# Altium project StudioLightingDriver.PrjPcb (part 1 of 2)
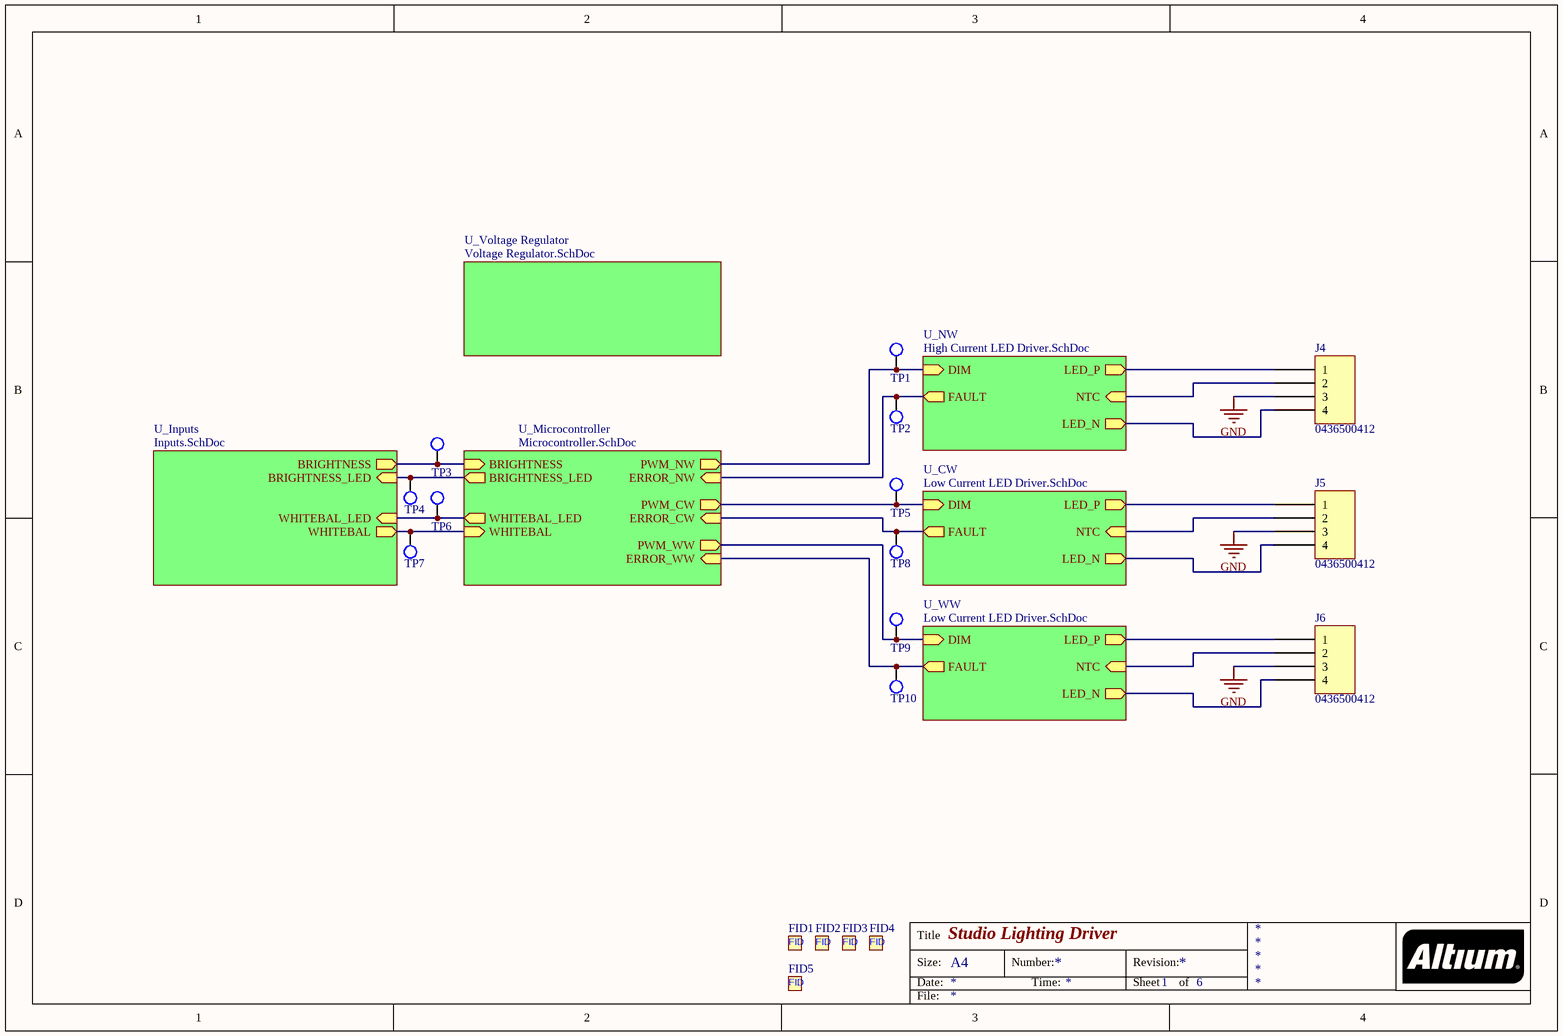
[diagram p0: Studio Lighting Driver.SchDoc]
6 sheets, 95 parts. Net scope: hierarchical (ports join the sheet entries above them; power ports are global).
Board file: LightingDriver.PcbDoc
Sheets:
  Studio Lighting Driver.SchDoc
    U_WW = Low Current LED Driver.SchDoc
    U_CW = Low Current LED Driver.SchDoc
    U_NW = High Current LED Driver.SchDoc
    U_Microcontroller = Microcontroller.SchDoc
    U_Voltage Regulator = Voltage Regulator.SchDoc
    U_Inputs = Inputs.SchDoc

## Sheet Studio Lighting Driver.SchDoc: Studio Lighting Driver
size A4; SheetNumber: 1; SheetTotal: 6

### Parts
FID1  Fiducial  [Fiducial-1mm]  (value not drawn)
FID2  Fiducial  [Fiducial-1mm]  (value not drawn)
FID3  Fiducial  [Fiducial-1mm]  (value not drawn)
FID4  Fiducial  [Fiducial-1mm]  (value not drawn)
FID5  Fiducial  [Fiducial-1mm]  (value not drawn)
J4  0436500412  [MOLEX 436500412]
J5  0436500412  [MOLEX 436500412]
J6  0436500412  [MOLEX 436500412]
TP1  Test Point  [TestPoint-1.5mm]  (value not drawn)  (no BOM)
TP2  Test Point  [TestPoint-1.5mm]  (value not drawn)  (no BOM)
TP3  Test Point  [TestPoint-1.5mm]  (value not drawn)  (no BOM)
TP4  Test Point  [TestPoint-1.5mm]  (value not drawn)  (no BOM)
TP5  Test Point  [TestPoint-1.5mm]  (value not drawn)  (no BOM)
TP6  Test Point  [TestPoint-1.5mm]  (value not drawn)  (no BOM)
TP7  Test Point  [TestPoint-1.5mm]  (value not drawn)  (no BOM)
TP8  Test Point  [TestPoint-1.5mm]  (value not drawn)  (no BOM)
TP9  Test Point  [TestPoint-1.5mm]  (value not drawn)  (no BOM)
TP10  Test Point  [TestPoint-1.5mm]  (value not drawn)  (no BOM)

### Sub-sheets
U_CW = Low Current LED Driver.SchDoc: LED_P (out), LED_N (out), DIM (in), NTC (in), FAULT (out)
U_Inputs = Inputs.SchDoc: BRIGHTNESS (out), BRIGHTNESS_LED (in), WHITEBAL (out), WHITEBAL_LED (in)
U_Microcontroller = Microcontroller.SchDoc: BRIGHTNESS (in), WHITEBAL (in), PWM_CW (out), PWM_WW (out), PWM_NW (out), ERROR_NW (in), ERROR_WW (in), ERROR_CW (in), BRIGHTNESS_LED (out), WHITEBAL_LED (out)
U_NW = High Current LED Driver.SchDoc: LED_P (out), LED_N (out), DIM (in), NTC (in), FAULT (out)
U_Voltage Regulator = Voltage Regulator.SchDoc: no entries
U_WW = Low Current LED Driver.SchDoc: LED_P (out), LED_N (out), DIM (in), NTC (in), FAULT (out)

### Nets
GND: J4.3 J5.3 J6.3
BRIGHTNESS: TP3.1(TP) ; sheet U_Microcontroller/BRIGHTNESS, sheet U_Inputs/BRIGHTNESS
BRIGHTNESS_LED: TP4.1(TP) ; sheet U_Microcontroller/BRIGHTNESS_LED, sheet U_Inputs/BRIGHTNESS_LED
DIM: TP1.1(TP) ; sheet U_NW/DIM, sheet U_Microcontroller/PWM_NW
DIM: TP9.1(TP) ; sheet U_WW/DIM, sheet U_Microcontroller/PWM_WW  [a separate net that carries the same name]
DIM: TP5.1(TP) ; sheet U_CW/DIM, sheet U_Microcontroller/PWM_CW  [a separate net that carries the same name]
ERROR_CW: TP8.1(TP) ; sheet U_CW/FAULT, sheet U_Microcontroller/ERROR_CW
ERROR_NW: TP2.1(TP) ; sheet U_NW/FAULT, sheet U_Microcontroller/ERROR_NW
ERROR_WW: TP10.1(TP) ; sheet U_WW/FAULT, sheet U_Microcontroller/ERROR_WW
LED_N: J4.4 ; sheet U_NW/LED_N
LED_N: J5.4 ; sheet U_CW/LED_N  [a separate net that carries the same name]
LED_N: J6.4 ; sheet U_WW/LED_N  [a separate net that carries the same name]
LED_P: J4.1 ; sheet U_NW/LED_P
LED_P: J5.1 ; sheet U_CW/LED_P  [a separate net that carries the same name]
LED_P: J6.1 ; sheet U_WW/LED_P  [a separate net that carries the same name]
NTC: J4.2 ; sheet U_NW/NTC
NTC: J5.2 ; sheet U_CW/NTC  [a separate net that carries the same name]
NTC: J6.2 ; sheet U_WW/NTC  [a separate net that carries the same name]
WHITEBAL: TP7.1(TP) ; sheet U_Microcontroller/WHITEBAL, sheet U_Inputs/WHITEBAL
WHITEBAL_LED: TP6.1(TP) ; sheet U_Microcontroller/WHITEBAL_LED, sheet U_Inputs/WHITEBAL_LED

### Notes on the sheet
- Title
- Size:
- Date:
- A4
- Number:
- Time:
- Revision:
- Sheet
- of
- File:
- (in symbol Fiducial) FID

### Library data of the parts
J4-J6 = 0436500412: CONN HEADER SMD R/A 4POS 3MM; Manufacturer: Molex; Material Flammability Rating: UL94 V-0; Number of Positions: 4; Number of Positions Loaded: All; Pitch - Mating: 0.118" (3.00mm); Shrouding: Shrouded - 4 Wall; Style: Board to Cable/Wire; Part Number: 0436500412; ComponentLink1Description: Datasheet; ComponentLink1URL: https://www.molex.com/pdm_docs/sd/436500412_sd.pdf; ComponentLink2Description: DigiKey Link; ComponentLink2URL: https://www.digikey.com/en/products/detail/molex/0436500412/3451041; Connector Type: Header; Contact Finish - Mating: Tin; Contact Finish - Post: Tin; Contact Finish Thickness - Mating: 60.0µin (1.52µm); Contact Material: Brass; Contact Shape: Square; Contact Type: Male Pin; Fastening Type: Locking Ramp; Features: Solder Retention; Insulation Color: Black; Insulation Height: 0.172" (4.37mm); Insulation Material: Liquid Crystal Polymer (LCP), Glass Filled; LastUpdated: 21/03/2022 20:35:03; Lifecycle Status: Active; Minimum Order: 1; Mounting Type: Surface Mount, Right Angle; Number of Rows: 1; Packaging: TapeAndReel; PartId: 134; Part Status: Active; Price: 1.64; Series: Micro-Fit 3.0 43650; Supplier 1: DigiKey; Supplier Part Number 1: WM1892CT-ND; Termination: Solder

## Sheet Low Current LED Driver.SchDoc: Low Current Driver
size A4; SheetNumber: 2; SheetTotal: 6
Used 2 times, as channels U_WW, U_CW. Parts and nets are listed once, with the designators drawn on the sheet.
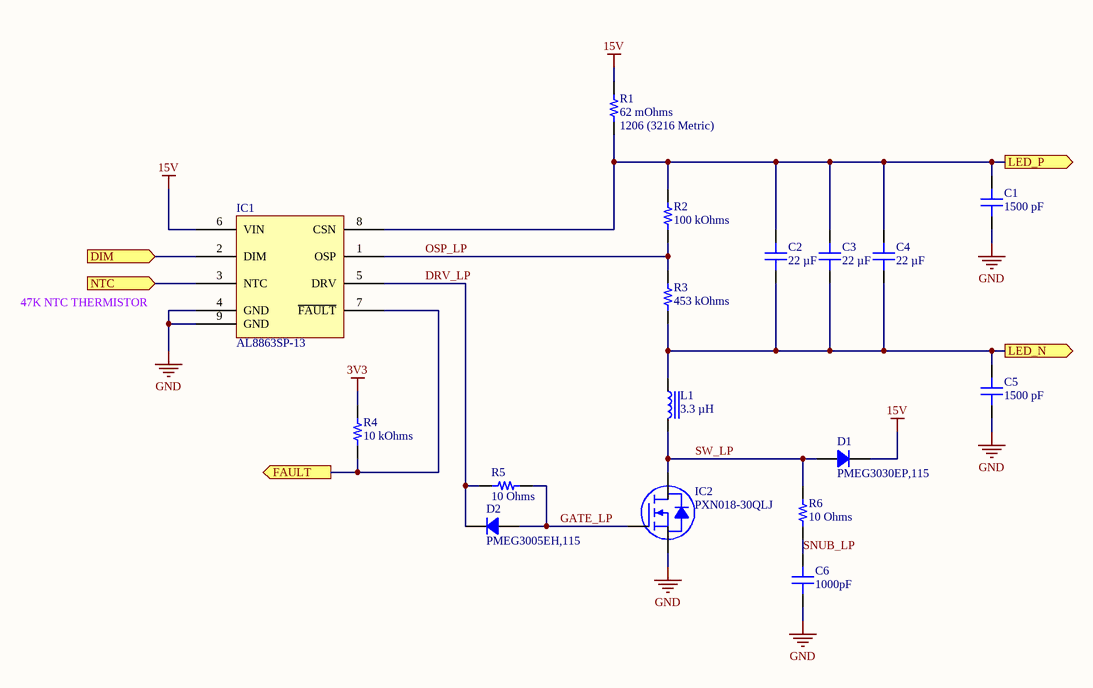
[diagram p1: Low Current LED Driver.SchDoc]

### Parts
C1  1500 pF  [CAP 0603_1608]
C2  22 µF  [CAP 1210_3225 - 1MM]
C3  22 µF  [CAP 1210_3225 - 1MM]
C4  22 µF  [CAP 1210_3225 - 1MM]
C5  1500 pF  [CAP 0603_1608]
C6  1000pF  [CAP 0603_1608]
D1  PMEG3030EP,115  [NEXPERIA SOD-128 CFP5]
D2  PMEG3005EH,115  [SOD123F]
IC1  AL8863SP-13  [DIODES INC SO-8EP]
IC2  PXN018-30QLJ  [NEXPERIA MLPAK33 SOT8002-1]
L1  3.3 µH  [TAIYO YUDEN NRS8030]
R1  62 mOhms  Package / Case: 1206 (3216 Metric)  [STACKPOLE CSR1206]
R2  100 kOhms  [RES 0603_1608]
R3  453 kOhms  [RES 0603_1608]
R4  10 kOhms  [RES 0603_1608]
R5  10 Ohms  [RES 0805_2012]
R6  10 Ohms  [RES 0805_2012]

### Ports
DIM (in), FAULT (out), LED_N (out), LED_P (out), NTC (in)

### Nets
3V3: R4.2
15V: D1.2 IC1.6(VIN) R1.2
GND: C1.1 C5.1 C6.1 IC1.4(GND) IC1.9(GND) IC2.S
DIM: IC1.2(DIM) ; port DIM
DRV_LP: D2.2 IC1.5(DRV) R5.1
FAULT: IC1.7(~{FAULT}) R4.1 ; port FAULT
GATE_LP: D2.1 IC2.G R5.2
LED_N: C2.1 C3.1 C4.1 C5.2 L1.2 R3.1 ; port LED_N
LED_P: C1.2 C2.2 C3.2 C4.2 IC1.8(CSN) R1.1 R2.2 ; port LED_P
NTC: IC1.3(NTC) ; port NTC
OSP_LP: IC1.1(OSP) R2.1 R3.2
SNUB_LP: C6.2 R6.1
SW_LP: D1.1 IC2.D L1.1 R6.2

### Channels
U_WW: designators end in _U_WW; ports DIM=DIM FAULT=ERROR_WW LED_N=LED_N LED_P=LED_P NTC=NTC
U_CW: designators end in _U_CW; ports DIM=DIM FAULT=ERROR_CW LED_N=LED_N LED_P=LED_P NTC=NTC

### Notes on the sheet
- 47K NTC THERMISTOR
- Title
- Size:
- Date:
- A4
- Number:
- Time:
- Revision:
- Sheet
- of
- File:

### Library data of the parts
C1 C5 = 0603N152J500CT: CAP CER 1500PF 50V C0G/NP0 0603; manufacturer: Walsin Technology Corporation; Temperature Coefficient: C0G, NP0; Tolerance: ±5%; Part Number: 0603N152J500CT; Value: 1500 pF; Applications: General Purpose; Capacitance: 1500 pF; componentlink1description: Datasheet; componentlink1url: http://www.passivecomponent.com/wp-content/uploads/2018/10/MLCC.pdf; componentlink2description: DigiKey Link; componentlink2url: https://www.digikey.com/en/products/detail/walsin-technology-corporation/0603N152J500CT/9354986; Device Package: 0603 (1608 Metric); lastupdated: 16/03/2022 06:22:23; Lifecycle Status: Active; Minimum Order: 1; Mounting Type: Surface Mount, MLCC; Operating Temperature: -55°C ~ 125°C; Package / Case: 0603 (1608 Metric); packaging: TapeAndReel; partid: 13065; Part Status: Active; price: 0.01; series: -; Size / Dimension: 0.063" L x 0.031" W (1.60mm x 0.80mm); Supplier 1: DigiKey; Supplier Part Number 1: 1292-1489-1-ND; Thickness (Max): 0.037" (0.95mm); Voltage - Rated: 50V
C2-C4 = CL32A226KAJNNNE: CAP CER 22UF 25V X5R 1210; manufacturer: Samsung Electro-Mechanics; Tolerance: ±10%; Part Number: CL32A226KAJNNNE; Value: 22 µF; Applications: General Purpose; Capacitance: 22 µF; componentlink1description: Datasheet; componentlink1url: http://www.samsungsem.com/kr/support/product-search/mlcc/CL32A226KAJNNNE.jsp; componentlink2description: DigiKey Link; componentlink2url: https://www.digikey.com/en/products/detail/samsung-electro-mechanics/CL32A226KAJNNNE/3886759; Device Package: 1210 (3225 Metric); lastupdated: 16/03/2022 06:41:57; Lifecycle Status: Active; Minimum Order: 1; Mounting Type: Surface Mount, MLCC; Operating Temperature: -55°C ~ 85°C; Package / Case: 1210 (3225 Metric); packaging: TapeAndReel; partid: 39435; Part Status: Active; price: 0.11; series: CL; Size / Dimension: 0.126" L x 0.098" W (3.20mm x 2.50mm); Supplier 1: DigiKey; Supplier Part Number 1: 1276-1101-1-ND; Temperature Coefficient: X5R; Thickness (Max): 0.106" (2.70mm); Voltage - Rated: 25V
C6 = 06035C102KAT2A: CAP CER 1000PF 50V X7R 0603; manufacturer: AVX Corporation; Tolerance: ±10%; Part Number: 06035C102KAT2A; Value: 1000pF; Applications: General Purpose; Capacitance: 1000pF; componentlink1description: Datasheet; componentlink1url: http://datasheets.avx.com/X7RDielectric.pdf; componentlink2description: DigiKey Link; componentlink2url: http://digikey.com/product-detail/en/avx-corporation/06035C102KAT2A/478-1215-1-ND/564247; Device Package: 0603 (1608 Metric); lastupdated: 02/09/2020 01:03:30; Lifecycle Status: Active; Minimum Order: 1; Mounting Type: Surface Mount, MLCC; Operating Temperature: -55°C ~ 125°C; Package / Case: 0603 (1608 Metric); packaging: TapeAndReel; partid: 5544; Part Status: Active; price: 0.01; series: -; Size / Dimension: 0.063" L x 0.032" W (1.60mm x 0.81mm); Supplier 1: DigiKey; Supplier Part Number 1: 478-1215-1-ND; Temperature Coefficient: X7R; Thickness (Max): 0.035" (0.90mm); Voltage - Rated: 50V
D1 = PMEG3030EP,115: DIODE SCHOTTKY 30V 3A CFP5; Manufacturer: Nexperia USA Inc.; Capacitance @ Vr, F: 470pF @ 1V, 1MHz; Current - Reverse Leakage @ Vr: 5 mA @ 30 V; Speed: Fast Recovery =< 500ns, > 200mA (Io); Voltage - Forward (Vf) (Max) @ If: 360 mV @ 3 A; Part Number: PMEG3030EP,115; ComponentLink1Description: Datasheet; ComponentLink1URL: https://assets.nexperia.com/documents/data-sheet/PMEG3030EP.pdf; ComponentLink2Description: DigiKey Link; ComponentLink2URL: https://www.digikey.com/en/products/detail/nexperia-usa-inc/PMEG3030EP-115/2228693; Current - Average Rectified (Io): 3A; Diode Type: Schottky; LastUpdated: 16/03/2022 11:28:51; Lifecycle Status: Active; Minimum Order: 1; Mounting Type: Surface Mount; Operating Temperature - Junction: 150°C (Max); Package / Case: SOD-128; Packaging: TapeAndReel; PartId: 3379; Part Status: Active; Price: 0.16; Series: -; Supplier 1: DigiKey; Supplier Part Number 1: 1727-5324-1-ND; Supplier Device Package: SOD-128/CFP5; Voltage - DC Reverse (Vr) (Max): 30 V
D2 = PMEG3005EH,115: DIODE SCHOTTKY 30V 500MA SOD123F; Manufacturer: Nexperia USA Inc.; Capacitance @ Vr, F: 70pF @ 1V, 1MHz; Current - Average Rectified (Io): 500mA (DC); Current - Reverse Leakage @ Vr: 150 µA @ 30 V; Speed: Fast Recovery =< 500ns, > 200mA (Io); Voltage - Forward (Vf) (Max) @ If: 430 mV @ 500 mA; Part Number: PMEG3005EH,115; ComponentLink1Description: Datasheet; ComponentLink1URL: https://assets.nexperia.com/documents/data-sheet/PMEGXX05EH_EJ_SER.pdf; ComponentLink2Description: DigiKey Link; ComponentLink2URL: https://www.digikey.com/en/products/detail/nexperia-usa-inc/PMEG3005EH-115/1157689; Diode Type: Schottky; LastUpdated: 16/03/2022 07:00:41; Lifecycle Status: Active; Minimum Order: 1; Mounting Type: Surface Mount; Operating Temperature - Junction: 150°C (Max); Package / Case: SOD-123F; Packaging: TapeAndReel; PartId: 2471; Part Status: Active; Price: 0.05; Series: -; Supplier 1: DigiKey; Supplier Part Number 1: 1727-3865-1-ND; Supplier Device Package: SOD-123F; Voltage - DC Reverse (Vr) (Max): 30 V
IC1 = AL8863SP-13: LED MV INT SWITCH SO-8EP; Manufacturer: Diodes Incorporated; Dimming: PWM; Frequency: 50kHz ~ 1MHz; Internal Switch(s): No; Number of Outputs: 1; Topology: Step-Down (Buck); Voltage - Supply (Max): 60V; Voltage - Supply (Min): 4.5V; Part Number: AL8863SP-13; Applications: Commercial & Industrial Lighting; ComponentLink1Description: Datasheet; ComponentLink1URL: https://www.diodes.com/assets/Datasheets/AL8863.pdf; ComponentLink2Description: DigiKey Link; ComponentLink2URL: https://www.digikey.com/en/products/detail/diodes-incorporated/AL8863SP-13/10481155; LastUpdated: 16/03/2022 13:00:06; Lifecycle Status: Active; Minimum Order: 1; Mounting Type: Surface Mount; Operating Temperature: -40°C ~ 125°C (TA); Package / Case: 8-SOIC (0.154", 3.90mm Width) Exposed Pad; Packaging: TapeAndReel; PartId: 9; Part Status: Active; Price: 0.23; Series: -; Supplier 1: DigiKey; Supplier Part Number 1: 31-AL8863SP-13CT-ND; Supplier Device Package: 8-SO-EP; Type: DC DC Controller
IC2 = PXN018-30QLJ: PXN018-30QL/SOT8002/MLPAK33; Manufacturer: Nexperia USA Inc.; Current - Continuous Drain (Id) @ 25°C: 7.5A (Ta), 19.2A (Tc); Drain to Source Voltage (Vdss): 30 V; Drive Voltage (Max Rds On,  Min Rds On): 4.5V, 10V; FET Type: N-Channel; Gate Charge (Qg) (Max) @ Vgs: 10.8 nC @ 10 V; Input Capacitance (Ciss) (Max) @ Vds: 447 pF @ 15 V; Power Dissipation (Max): 1.7W (Ta), 10.9W (Tc); Rds On (Max) @ Id, Vgs: 18mOhm @ 7.5A, 10V; Vgs (Max): ±20V; Vgs(th) (Max) @ Id: 2.5V @ 250µA; Part Number: PXN018-30QLJ; ComponentLink1Description: Datasheet; ComponentLink1URL: https://assets.nexperia.com/documents/data-sheet/PXN018-30QL.pdf; ComponentLink2Description: DigiKey Link; ComponentLink2URL: https://www.digikey.com/en/products/detail/nexperia-usa-inc/PXN018-30QLJ/13690066; LastUpdated: 16/03/2022 13:32:54; Lifecycle Status: Active; Minimum Order: 1; Mounting Type: Surface Mount; Operating Temperature: -55°C ~ 150°C (TJ); Packaging: TapeAndReel; Part Status: Active; Price: 0.18; Series: -; Supplier 1: DigiKey; Supplier Part Number 1: 1727-PXN018-30QLJCT-ND; Supplier Device Package: MLPAK33; Technology: MOSFET (Metal Oxide)
L1 = NRS8030T3R3MJGJ: FIXED IND 3.3UH 4.3A 19 MOHM SMD; Manufacturer: Taiyo Yuden; Current - Saturation: 4.2A; DC Resistance (DCR): 19mOhm; Frequency - Self Resonant: 50MHz; Inductance Frequency - Test: 100 kHz; Material - Core: Ferrite; Shielding: Shielded; Tolerance: ±20%; Type: Wirewound; Part Number: NRS8030T3R3MJGJ; ComponentLink1Description: Datasheet; ComponentLink1URL: https://www.yuden.co.jp/productdata/catalog/wound04_e.pdf; ComponentLink2Description: DigiKey Link; ComponentLink2URL: https://www.digikey.com/en/products/detail/taiyo-yuden/NRS8030T3R3MJGJ/2666005; Current Rating (Amps): 4.3 A; Device Package: Nonstandard; Height - Seated (Max): 0.118" (3.00mm); Inductance: 3.3 µH; LastUpdated: 16/03/2022 11:26:54; Lifecycle Status: Active; Minimum Order: 1; Mounting Type: Surface Mount; Operating Temperature: -25°C ~ 125°C; Package / Case: Nonstandard; Packaging: TapeAndReel; PartId: 5492; Part Status: Active; Price: 0.21; Series: NR, S Type; Size / Dimension: 0.315" L x 0.315" W (8.00mm x 8.00mm); Supplier 1: DigiKey; Supplier Part Number 1: 587-2967-1-ND; Value: 3.3 µH
R1 = RLP73N2BR062FTDF: RES 0.062 OHM 1% 1/2W 1206; Manufacturer: TE Connectivity Passive Product; Power (Watts): 0.5W, 1/2W; Temperature Coefficient: ±300ppm/°C; Part Number: RLP73N2BR062FTDF; ComponentLink1Description: Datasheet; ComponentLink1URL: https://www.te.com/commerce/DocumentDelivery/DDEController?Action=srchrtrv&DocNm=1773269&DocType=DS&DocLang=English; ComponentLink2Description: DigiKey Link; ComponentLink2URL: http://digikey.com/product-detail/en/te-connectivity-passive-product/RLP73N2BR062FTDF/A109640CT-ND/4032406; Composition: Thick Film; Device Package: 1206 (3216 Metric); Features: Current Sense; Height - Seated (Max): 0.026" (0.65mm); LastUpdated: 16/03/2022 06:58:00; Lifecycle Status: Active; Minimum Order: 1; Number of Terminations: 2; Operating Temperature: -55°C ~ 155°C; Packaging: TapeAndReel; PartId: 2646; Part Status: Active; Price: 0.14; Resistance: 62 mOhms; Series: RL73, CGS; Size / Dimension: 0.122" L x 0.061" W (3.10mm x 1.55mm); Supplier 1: DigiKey; Supplier Part Number 1: A109640CT-ND; Supplier Device Package: 1206; Tolerance: ±1%; Value: 62 mOhms
R2 = CRCW0603100KFKEAC: RES 100K OHM 1% 1/10W 0603; Manufacturer: Vishay Dale; Power (Watts): 0.1W, 1/10W; Temperature Coefficient: ±100ppm/°C; Part Number: CRCW0603100KFKEAC; Value: 100 kOhms; ComponentLink1Description: Datasheet; ComponentLink1URL: http://www.vishay.com/docs/28773/crcwce3.pdf; ComponentLink2Description: DigiKey Link; ComponentLink2URL: https://www.digikey.com/en/products/detail/vishay-dale/CRCW0603100KFKEAC/7928372; Composition: Thick Film; Device Package: 0603 (1608 Metric); Height - Seated (Max): 0.022" (0.55mm); LastUpdated: 16/03/2022 06:41:03; Lifecycle Status: Active; Minimum Order: 1; Number of Terminations: 2; Operating Temperature: -55°C ~ 155°C; Package / Case: 0603 (1608 Metric); Packaging: CutTape; PartId: 12549; Part Status: Active; Price: 0.01; Resistance: 100 kOhms; Series: CRCW-C; Supplier 1: DigiKey; Supplier Part Number 1: 541-3950-1-ND; Supplier Device Package: 0603; Tolerance: ±1%
R3 = RMCF0603FT453K: RES 453K OHM 1% 1/10W 0603; Manufacturer: Stackpole Electronics Inc; Power (Watts): 0.1W, 1/10W; Temperature Coefficient: ±100ppm/°C; Part Number: RMCF0603FT453K; Value: 453 kOhms; ComponentLink1Description: Datasheet; ComponentLink1URL: https://www.seielect.com/catalog/sei-rmcf_rmcp.pdf; ComponentLink2Description: DigiKey Link; ComponentLink2URL: https://www.digikey.com/en/products/detail/stackpole-electronics-inc/RMCF0603FT453K/1761122; Composition: Thick Film; Device Package: 0603 (1608 Metric); Features: Automotive AEC-Q200; Height - Seated (Max): 0.022" (0.55mm); LastUpdated: 16/03/2022 06:40:25; Lifecycle Status: Active; Minimum Order: 1; Number of Terminations: 2; Operating Temperature: -55°C ~ 155°C; Package / Case: 0603 (1608 Metric); Packaging: CutTape; PartId: 22558; Part Status: Active; Price: 0.01; Ratings: AEC-Q200; Resistance: 453 kOhms; Series: RMCF; Size / Dimension: 0.061" L x 0.031" W (1.55mm x 0.80mm); Supplier 1: DigiKey; Supplier Part Number 1: RMCF0603FT453KCT-ND; Supplier Device Package: 0603; Tolerance: ±1%
R4 = ERJ-3GEYJ103V: RES SMD 10K OHM 5% 1/10W 0603; Manufacturer: Panasonic Electronic Components; Power (Watts): 0.1W, 1/10W; Temperature Coefficient: ±200ppm/°C; Part Number: ERJ-3GEYJ103V; Value: 10 kOhms; ComponentLink1Description: Datasheet; ComponentLink1URL: http://industrial.panasonic.com/www-cgi/jvcr13pz.cgi?E+PZ+3+AOA0001+ERJ3GEYJ103V+7+WW; ComponentLink2Description: DigiKey Link; ComponentLink2URL: https://www.digikey.com/en/products/detail/panasonic-electronic-components/ERJ-3GEYJ103V/135662; Composition: Thick Film; Device Package: 0603 (1608 Metric); Features: Automotive AEC-Q200; Height - Seated (Max): 0.022" (0.55mm); LastUpdated: 16/03/2022 06:40:24; Lifecycle Status: Active; Minimum Order: 1; Number of Terminations: 2; Operating Temperature: -55°C ~ 155°C; Package / Case: 0603 (1608 Metric); Packaging: TapeAndReel; PartId: 22604; Part Status: Active; Price: 0.01; Ratings: AEC-Q200; Resistance: 10 kOhms; Series: ERJ-3G; Size / Dimension: 0.063" L x 0.031" W (1.60mm x 0.80mm); Supplier 1: DigiKey; Supplier Part Number 1: P10KGCT-ND; Supplier Device Package: 0603; Tolerance: ±5%
R5 R6 = CRCW080510R0JNEAC: RES 10 OHM 5% 1/8W 0805; Manufacturer: Vishay Dale; Power (Watts): 0.125W, 1/8W; Temperature Coefficient: ±200ppm/°C; Part Number: CRCW080510R0JNEAC; Value: 10 Ohms; ComponentLink1Description: Datasheet; ComponentLink1URL: http://www.vishay.com/docs/28773/crcwce3.pdf; ComponentLink2Description: DigiKey Link; ComponentLink2URL: https://www.digikey.com/en/products/detail/vishay-dale/CRCW080510R0JNEAC/7928589; Composition: Thick Film; Device Package: 0805 (2012 Metric); Height - Seated (Max): 0.024" (0.60mm); LastUpdated: 16/03/2022 06:53:04; Lifecycle Status: Active; Minimum Order: 1; Number of Terminations: 2; Operating Temperature: -55°C ~ 155°C; Package / Case: 0805 (2012 Metric); Packaging: TapeAndReel; PartId: 37142; Part Status: Active; Price: 0.01; Resistance: 10 Ohms; Series: CRCW-C; Size / Dimension: 0.079" L x 0.049" W (2.00mm x 1.25mm); Supplier 1: DigiKey; Supplier Part Number 1: 541-4167-1-ND; Supplier Device Package: 0805; Tolerance: ±5%

## Sheet High Current LED Driver.SchDoc: High Current Driver
size A4; SheetNumber: 3; SheetTotal: 6
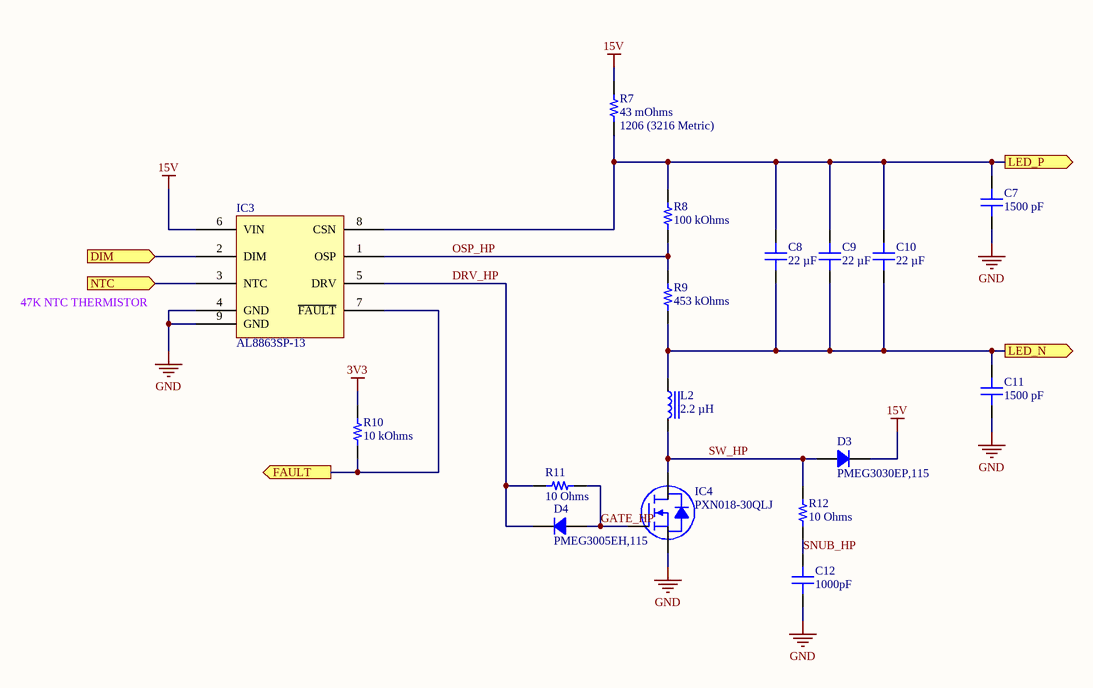
[diagram p2: High Current LED Driver.SchDoc]

### Parts
C7  1500 pF  [CAP 0603_1608]
C8  22 µF  [CAP 1210_3225 - 1MM]
C9  22 µF  [CAP 1210_3225 - 1MM]
C10  22 µF  [CAP 1210_3225 - 1MM]
C11  1500 pF  [CAP 0603_1608]
C12  1000pF  [CAP 0603_1608]
D3  PMEG3030EP,115  [NEXPERIA SOD-128 CFP5]
D4  PMEG3005EH,115  [SOD123F]
IC3  AL8863SP-13  [DIODES INC SO-8EP]
IC4  PXN018-30QLJ  [NEXPERIA MLPAK33 SOT8002-1]
L2  2.2 µH  [TAIYO YUDEN NRS8030]
R7  43 mOhms  Package / Case: 1206 (3216 Metric)  [STACKPOLE CSR1206]
R8  100 kOhms  [RES 0603_1608]
R9  453 kOhms  [RES 0603_1608]
R10  10 kOhms  [RES 0603_1608]
R11  10 Ohms  [RES 0805_2012]
R12  10 Ohms  [RES 0805_2012]

### Ports
DIM (in), FAULT (out), LED_N (out), LED_P (out), NTC (in)

### Nets
3V3: R10.2
15V: D3.2 IC3.6(VIN) R7.2
GND: C7.1 C11.1 C12.1 IC3.4(GND) IC3.9(GND) IC4.S
DIM: IC3.2(DIM) ; port DIM
DRV_HP: D4.2 IC3.5(DRV) R11.1
ERROR_NW: IC3.7(~{FAULT}) R10.1 ; port FAULT
GATE_HP: D4.1 IC4.G R11.2
LED_N: C8.1 C9.1 C10.1 C11.2 L2.2 R9.1 ; port LED_N
LED_P: C7.2 C8.2 C9.2 C10.2 IC3.8(CSN) R7.1 R8.2 ; port LED_P
NTC: IC3.3(NTC) ; port NTC
OSP_HP: IC3.1(OSP) R8.1 R9.2
SNUB_HP: C12.2 R12.1
SW_HP: D3.1 IC4.D L2.1 R12.2

### Notes on the sheet
- 47K NTC THERMISTOR
- Title
- Size:
- Date:
- A4
- Number:
- Time:
- Revision:
- Sheet
- of
- File:

### Library data of the parts
C7 C11 = 0603N152J500CT: as C1 on sheet Low Current LED Driver; Part Number: 0603N152J500CT; Value: 1500 pF; Applications: General Purpose; Capacitance: 1500 pF; componentlink1description: Datasheet; componentlink1url: http://www.passivecomponent.com/wp-content/uploads/2018/10/MLCC.pdf; componentlink2description: DigiKey Link; componentlink2url: https://www.digikey.com/en/products/detail/walsin-technology-corporation/0603N152J500CT/9354986; Device Package: 0603 (1608 Metric); lastupdated: 16/03/2022 06:22:23; Lifecycle Status: Active; Minimum Order: 1; Mounting Type: Surface Mount, MLCC; Operating Temperature: -55°C ~ 125°C; Package / Case: 0603 (1608 Metric); packaging: TapeAndReel; partid: 13065; Part Status: Active; price: 0.01; series: -; Size / Dimension: 0.063" L x 0.031" W (1.60mm x 0.80mm); Supplier 1: DigiKey; Supplier Part Number 1: 1292-1489-1-ND; Thickness (Max): 0.037" (0.95mm); Voltage - Rated: 50V
C8-C10 = CL32A226KAJNNNE: as C2 on sheet Low Current LED Driver; Part Number: CL32A226KAJNNNE; Value: 22 µF; Applications: General Purpose; Capacitance: 22 µF; componentlink1description: Datasheet; componentlink1url: http://www.samsungsem.com/kr/support/product-search/mlcc/CL32A226KAJNNNE.jsp; componentlink2description: DigiKey Link; componentlink2url: https://www.digikey.com/en/products/detail/samsung-electro-mechanics/CL32A226KAJNNNE/3886759; Device Package: 1210 (3225 Metric); lastupdated: 16/03/2022 06:41:57; Lifecycle Status: Active; Minimum Order: 1; Mounting Type: Surface Mount, MLCC; Operating Temperature: -55°C ~ 85°C; Package / Case: 1210 (3225 Metric); packaging: TapeAndReel; partid: 39435; Part Status: Active; price: 0.11; series: CL; Size / Dimension: 0.126" L x 0.098" W (3.20mm x 2.50mm); Supplier 1: DigiKey; Supplier Part Number 1: 1276-1101-1-ND; Temperature Coefficient: X5R; Thickness (Max): 0.106" (2.70mm); Voltage - Rated: 25V
C12 = 06035C102KAT2A: as C6 on sheet Low Current LED Driver; Part Number: 06035C102KAT2A; Value: 1000pF; Applications: General Purpose; Capacitance: 1000pF; componentlink1description: Datasheet; componentlink1url: http://datasheets.avx.com/X7RDielectric.pdf; componentlink2description: DigiKey Link; componentlink2url: http://digikey.com/product-detail/en/avx-corporation/06035C102KAT2A/478-1215-1-ND/564247; Device Package: 0603 (1608 Metric); lastupdated: 02/09/2020 01:03:30; Lifecycle Status: Active; Minimum Order: 1; Mounting Type: Surface Mount, MLCC; Operating Temperature: -55°C ~ 125°C; Package / Case: 0603 (1608 Metric); packaging: TapeAndReel; partid: 5544; Part Status: Active; price: 0.01; series: -; Size / Dimension: 0.063" L x 0.032" W (1.60mm x 0.81mm); Supplier 1: DigiKey; Supplier Part Number 1: 478-1215-1-ND; Temperature Coefficient: X7R; Thickness (Max): 0.035" (0.90mm); Voltage - Rated: 50V
D3 = PMEG3030EP,115: as D1 on sheet Low Current LED Driver; Part Number: PMEG3030EP,115; ComponentLink1Description: Datasheet; ComponentLink1URL: https://assets.nexperia.com/documents/data-sheet/PMEG3030EP.pdf; ComponentLink2Description: DigiKey Link; ComponentLink2URL: https://www.digikey.com/en/products/detail/nexperia-usa-inc/PMEG3030EP-115/2228693; Current - Average Rectified (Io): 3A; Diode Type: Schottky; LastUpdated: 16/03/2022 11:28:51; Lifecycle Status: Active; Minimum Order: 1; Mounting Type: Surface Mount; Operating Temperature - Junction: 150°C (Max); Package / Case: SOD-128; Packaging: TapeAndReel; PartId: 3379; Part Status: Active; Price: 0.16; Series: -; Supplier 1: DigiKey; Supplier Part Number 1: 1727-5324-1-ND; Supplier Device Package: SOD-128/CFP5; Voltage - DC Reverse (Vr) (Max): 30 V
D4 = PMEG3005EH,115: as D2 on sheet Low Current LED Driver; Part Number: PMEG3005EH,115; ComponentLink1Description: Datasheet; ComponentLink1URL: https://assets.nexperia.com/documents/data-sheet/PMEGXX05EH_EJ_SER.pdf; ComponentLink2Description: DigiKey Link; ComponentLink2URL: https://www.digikey.com/en/products/detail/nexperia-usa-inc/PMEG3005EH-115/1157689; Diode Type: Schottky; LastUpdated: 16/03/2022 07:00:41; Lifecycle Status: Active; Minimum Order: 1; Mounting Type: Surface Mount; Operating Temperature - Junction: 150°C (Max); Package / Case: SOD-123F; Packaging: TapeAndReel; PartId: 2471; Part Status: Active; Price: 0.05; Series: -; Supplier 1: DigiKey; Supplier Part Number 1: 1727-3865-1-ND; Supplier Device Package: SOD-123F; Voltage - DC Reverse (Vr) (Max): 30 V
IC3 = AL8863SP-13: as IC1 on sheet Low Current LED Driver; Part Number: AL8863SP-13; Applications: Commercial & Industrial Lighting; ComponentLink1Description: Datasheet; ComponentLink1URL: https://www.diodes.com/assets/Datasheets/AL8863.pdf; ComponentLink2Description: DigiKey Link; ComponentLink2URL: https://www.digikey.com/en/products/detail/diodes-incorporated/AL8863SP-13/10481155; LastUpdated: 16/03/2022 13:00:06; Lifecycle Status: Active; Minimum Order: 1; Mounting Type: Surface Mount; Operating Temperature: -40°C ~ 125°C (TA); Package / Case: 8-SOIC (0.154", 3.90mm Width) Exposed Pad; Packaging: TapeAndReel; PartId: 9; Part Status: Active; Price: 0.23; Series: -; Supplier 1: DigiKey; Supplier Part Number 1: 31-AL8863SP-13CT-ND; Supplier Device Package: 8-SO-EP; Type: DC DC Controller
IC4 = PXN018-30QLJ: as IC2 on sheet Low Current LED Driver; Part Number: PXN018-30QLJ; ComponentLink1Description: Datasheet; ComponentLink1URL: https://assets.nexperia.com/documents/data-sheet/PXN018-30QL.pdf; ComponentLink2Description: DigiKey Link; ComponentLink2URL: https://www.digikey.com/en/products/detail/nexperia-usa-inc/PXN018-30QLJ/13690066; LastUpdated: 16/03/2022 13:32:54; Lifecycle Status: Active; Minimum Order: 1; Mounting Type: Surface Mount; Operating Temperature: -55°C ~ 150°C (TJ); Packaging: TapeAndReel; Part Status: Active; Price: 0.18; Series: -; Supplier 1: DigiKey; Supplier Part Number 1: 1727-PXN018-30QLJCT-ND; Supplier Device Package: MLPAK33; Technology: MOSFET (Metal Oxide)
L2 = NRS8030T2R2NJGJ: FIXED IND 2.2UH 4.8A 19.5MOHM SM; Manufacturer: Taiyo Yuden; Current - Saturation: 4.9A; DC Resistance (DCR): 19.5mOhm Max; Frequency - Self Resonant: 60MHz; Inductance Frequency - Test: 100 kHz; Material - Core: Ferrite; Shielding: Shielded; Tolerance: ±30%; Type: Wirewound; Part Number: NRS8030T2R2NJGJ; ComponentLink1Description: Datasheet; ComponentLink1URL: https://www.yuden.co.jp/productdata/catalog/wound04_e.pdf; ComponentLink2Description: DigiKey Link; ComponentLink2URL: https://www.digikey.com/en/products/detail/taiyo-yuden/NRS8030T2R2NJGJ/2666003; Current Rating (Amps): 4.8 A; Device Package: Nonstandard; Height - Seated (Max): 0.118" (3.00mm); Inductance: 2.2 µH; LastUpdated: 16/03/2022 13:29:46; Lifecycle Status: Active; Minimum Order: 1; Mounting Type: Surface Mount; Operating Temperature: -25°C ~ 125°C; Package / Case: Nonstandard; Packaging: TapeAndReel; PartId: 5494; Part Status: Active; Price: 0.21; Series: NR, S Type; Size / Dimension: 0.315" L x 0.315" W (8.00mm x 8.00mm); Supplier 1: DigiKey; Supplier Part Number 1: 587-2965-1-ND; Value: 2.2 µH
R7 = RLP73M2BR043JTD: RES 0.043 OHM 5% 1/2W 1206; Manufacturer: TE Connectivity Passive Product; Power (Watts): 0.5W, 1/2W; Temperature Coefficient: ±400ppm/°C; Part Number: RLP73M2BR043JTD; ComponentLink1Description: Datasheet; ComponentLink1URL: https://www.te.com/commerce/DocumentDelivery/DDEController?Action=srchrtrv&DocNm=1773269&DocType=DS&DocLang=English; ComponentLink2Description: DigiKey Link; ComponentLink2URL: https://www.digikey.com/en/products/detail/te-connectivity-passive-product/RLP73M2BR043JTD/4032208; Composition: Thick Film; Device Package: 1206 (3216 Metric); Features: Current Sense; Height - Seated (Max): 0.026" (0.65mm); LastUpdated: 16/03/2022 06:57:55; Lifecycle Status: Active; Minimum Order: 1; Number of Terminations: 2; Operating Temperature: -55°C ~ 155°C; Packaging: TapeAndReel; PartId: 2125; Part Status: Active; Price: 0.10; Resistance: 43 mOhms; Series: RL73, CGS; Size / Dimension: 0.122" L x 0.061" W (3.10mm x 1.55mm); Supplier 1: DigiKey; Supplier Part Number 1: A109833CT-ND; Supplier Device Package: 1206; Tolerance: ±5%; Value: 43 mOhms
R8 = CRCW0603100KFKEAC: as R2 on sheet Low Current LED Driver; Part Number: CRCW0603100KFKEAC; Value: 100 kOhms; ComponentLink1Description: Datasheet; ComponentLink1URL: http://www.vishay.com/docs/28773/crcwce3.pdf; ComponentLink2Description: DigiKey Link; ComponentLink2URL: https://www.digikey.com/en/products/detail/vishay-dale/CRCW0603100KFKEAC/7928372; Composition: Thick Film; Device Package: 0603 (1608 Metric); Height - Seated (Max): 0.022" (0.55mm); LastUpdated: 16/03/2022 06:41:03; Lifecycle Status: Active; Minimum Order: 1; Number of Terminations: 2; Operating Temperature: -55°C ~ 155°C; Package / Case: 0603 (1608 Metric); Packaging: CutTape; PartId: 12549; Part Status: Active; Price: 0.01; Resistance: 100 kOhms; Series: CRCW-C; Supplier 1: DigiKey; Supplier Part Number 1: 541-3950-1-ND; Supplier Device Package: 0603; Tolerance: ±1%
R9 = RMCF0603FT453K: as R3 on sheet Low Current LED Driver; Part Number: RMCF0603FT453K; Value: 453 kOhms; ComponentLink1Description: Datasheet; ComponentLink1URL: https://www.seielect.com/catalog/sei-rmcf_rmcp.pdf; ComponentLink2Description: DigiKey Link; ComponentLink2URL: https://www.digikey.com/en/products/detail/stackpole-electronics-inc/RMCF0603FT453K/1761122; Composition: Thick Film; Device Package: 0603 (1608 Metric); Features: Automotive AEC-Q200; Height - Seated (Max): 0.022" (0.55mm); LastUpdated: 16/03/2022 06:40:25; Lifecycle Status: Active; Minimum Order: 1; Number of Terminations: 2; Operating Temperature: -55°C ~ 155°C; Package / Case: 0603 (1608 Metric); Packaging: CutTape; PartId: 22558; Part Status: Active; Price: 0.01; Ratings: AEC-Q200; Resistance: 453 kOhms; Series: RMCF; Size / Dimension: 0.061" L x 0.031" W (1.55mm x 0.80mm); Supplier 1: DigiKey; Supplier Part Number 1: RMCF0603FT453KCT-ND; Supplier Device Package: 0603; Tolerance: ±1%
R10 = ERJ-3GEYJ103V: as R4 on sheet Low Current LED Driver; Part Number: ERJ-3GEYJ103V; Value: 10 kOhms; ComponentLink1Description: Datasheet; ComponentLink1URL: http://industrial.panasonic.com/www-cgi/jvcr13pz.cgi?E+PZ+3+AOA0001+ERJ3GEYJ103V+7+WW; ComponentLink2Description: DigiKey Link; ComponentLink2URL: https://www.digikey.com/en/products/detail/panasonic-electronic-components/ERJ-3GEYJ103V/135662; Composition: Thick Film; Device Package: 0603 (1608 Metric); Features: Automotive AEC-Q200; Height - Seated (Max): 0.022" (0.55mm); LastUpdated: 16/03/2022 06:40:24; Lifecycle Status: Active; Minimum Order: 1; Number of Terminations: 2; Operating Temperature: -55°C ~ 155°C; Package / Case: 0603 (1608 Metric); Packaging: TapeAndReel; PartId: 22604; Part Status: Active; Price: 0.01; Ratings: AEC-Q200; Resistance: 10 kOhms; Series: ERJ-3G; Size / Dimension: 0.063" L x 0.031" W (1.60mm x 0.80mm); Supplier 1: DigiKey; Supplier Part Number 1: P10KGCT-ND; Supplier Device Package: 0603; Tolerance: ±5%
R11 R12 = CRCW080510R0JNEAC: as R5 on sheet Low Current LED Driver; Part Number: CRCW080510R0JNEAC; Value: 10 Ohms; ComponentLink1Description: Datasheet; ComponentLink1URL: http://www.vishay.com/docs/28773/crcwce3.pdf; ComponentLink2Description: DigiKey Link; ComponentLink2URL: https://www.digikey.com/en/products/detail/vishay-dale/CRCW080510R0JNEAC/7928589; Composition: Thick Film; Device Package: 0805 (2012 Metric); Height - Seated (Max): 0.024" (0.60mm); LastUpdated: 16/03/2022 06:53:04; Lifecycle Status: Active; Minimum Order: 1; Number of Terminations: 2; Operating Temperature: -55°C ~ 155°C; Package / Case: 0805 (2012 Metric); Packaging: TapeAndReel; PartId: 37142; Part Status: Active; Price: 0.01; Resistance: 10 Ohms; Series: CRCW-C; Size / Dimension: 0.079" L x 0.049" W (2.00mm x 1.25mm); Supplier 1: DigiKey; Supplier Part Number 1: 541-4167-1-ND; Supplier Device Package: 0805; Tolerance: ±5%

## Sheet Microcontroller.SchDoc: Microcontroller
size A4; SheetNumber: 4; SheetTotal: 6
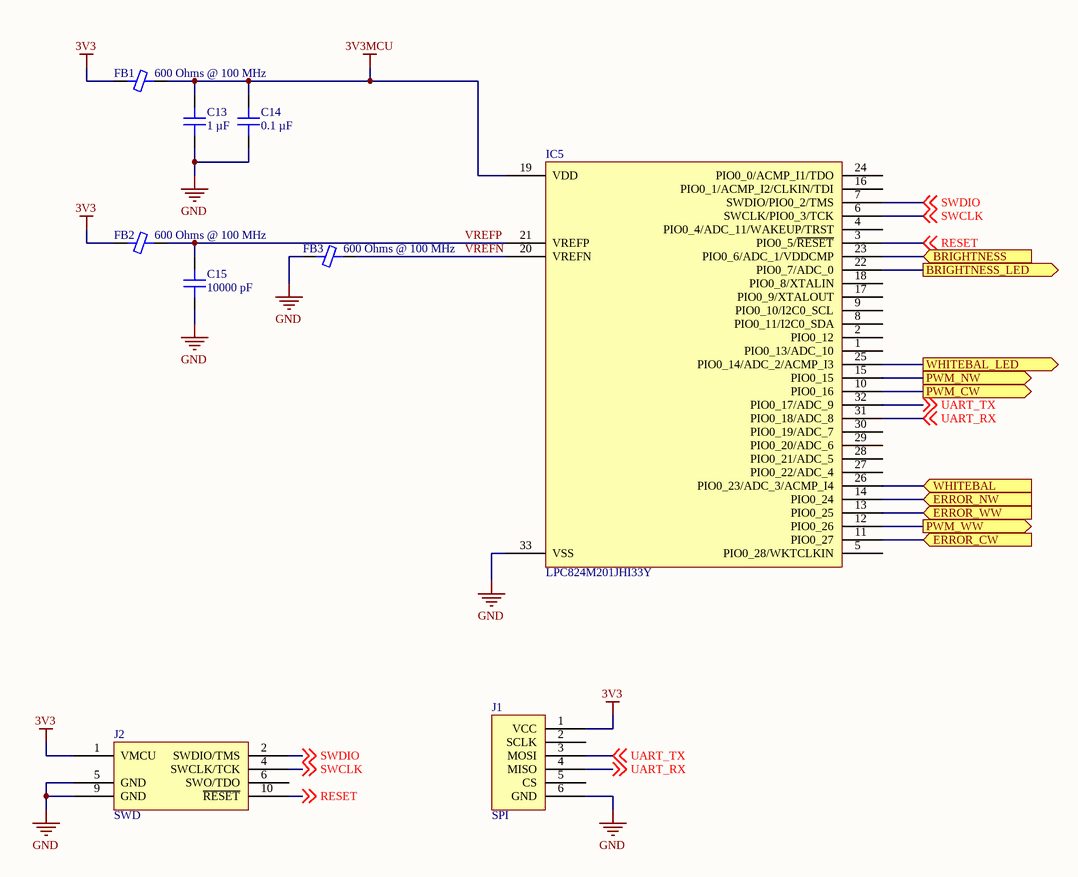
[diagram p3: Microcontroller.SchDoc]

### Parts
C13  1 µF  [CAP 0603_1608]
C14  0.1 µF  [CAP 0603_1608]
C15  10000 pF  [CAP 0603_1608]
FB1  600 Ohms @ 100 MHz  [FER 0603_1608]
FB2  600 Ohms @ 100 MHz  [FER 0603_1608]
FB3  600 Ohms @ 100 MHz  [FER 0603_1608]
IC5  LPC824M201JHI33Y  [NXP HVQFN-33 5X5MM]
J1  SPI  [SPI Breakout]
J2  SWD  [10 Pin SWD]  (no BOM)

### Ports
BRIGHTNESS (in), BRIGHTNESS_LED (out), ERROR_CW (in), ERROR_NW (in), ERROR_WW (in), PWM_CW (out), PWM_NW (out), PWM_WW (out), WHITEBAL (in), WHITEBAL_LED (out)

### Nets
3V3: FB1.1 FB2.1 J1.1(VCC) J2.1(VMCU)
3V3MCU: C13.2 C14.2 FB1.2 IC5.19(VDD)
GND: C13.1 C14.1 C15.1 FB3.1 IC5.33(VSS) J1.6(GND) J2.5(GND) J2.9(GND)
BRIGHTNESS: IC5.23(PIO0_6/ADC_1/VDDCMP) ; port BRIGHTNESS
BRIGHTNESS_LED: IC5.22(PIO0_7/ADC_0) ; port BRIGHTNESS_LED
DIM: IC5.15(PIO0_15) ; port PWM_NW
DIM: IC5.12(PIO0_26) ; port PWM_WW  [a separate net that carries the same name]
DIM: IC5.10(PIO0_16) ; port PWM_CW  [a separate net that carries the same name]
ERROR_CW: IC5.11(PIO0_27) ; port ERROR_CW
ERROR_NW: IC5.14(PIO0_24) ; port ERROR_NW
ERROR_WW: IC5.13(PIO0_25) ; port ERROR_WW
RESET: IC5.3(PIO0_5/~{RESET}) J2.10(~{RESET}) ; off-sheet RESET
SWCLK: IC5.6(SWCLK/PIO0_3/TCK) J2.4(SWCLK/TCK) ; off-sheet SWCLK
SWDIO: IC5.7(SWDIO/PIO0_2/TMS) J2.2(SWDIO/TMS) ; off-sheet SWDIO
UART_RX: IC5.31(PIO0_18/ADC_8) J1.4(MISO) ; off-sheet UART_RX
UART_TX: IC5.32(PIO0_17/ADC_9) J1.3(MOSI) ; off-sheet UART_TX
VREFN: FB3.2 IC5.20(VREFN)
VREFP: C15.2 FB2.2 IC5.21(VREFP)
WHITEBAL: IC5.26(PIO0_23/ADC_3/ACMP_I4) ; port WHITEBAL
WHITEBAL_LED: IC5.25(PIO0_14/ADC_2/ACMP_I3) ; port WHITEBAL_LED

Not connected (* = marked no-connect by the designer): IC5 1(PIO0_13/ADC_10) 2(PIO0_12) 4(PIO0_4/ADC_11/WAKEUP/TRST) 5(PIO0_28/WKTCLKIN) 8(PIO0_11/I2C0_SDA) 9(PIO0_10/I2C0_SCL) 16(PIO0_1/ACMP_I2/CLKIN/TDI) 17(PIO0_9/XTALOUT) 18(PIO0_8/XTALIN) 24(PIO0_0/ACMP_I1/TDO) 27(PIO0_22/ADC_4) 28(PIO0_21/ADC_5) 29(PIO0_20/ADC_6) 30(PIO0_19/ADC_7); J1 2(SCLK) 5(CS); J2 6(SWO/TDO)

### Notes on the sheet
- Title
- Size:
- Date:
- A4
- Number:
- Time:
- Revision:
- Sheet
- of
- File:

### Library data of the parts
C13 = CC0603KRX7R6BB105: CAP CER 1UF 10V X7R 0603; manufacturer: Yageo; Tolerance: ±10%; Part Number: CC0603KRX7R6BB105; Value: 1 µF; Applications: General Purpose; Capacitance: 1 µF; componentlink1description: Datasheet; componentlink1url: https://www.yageo.com/upload/media/product/productsearch/datasheet/mlcc/UPY-GPHC_X7R_6.3V-to-50V_18.pdf; componentlink2description: DigiKey Link; componentlink2url: https://www.digikey.com/en/products/detail/yageo/CC0603KRX7R6BB105/5195204; Device Package: 0603 (1608 Metric); lastupdated: 16/03/2022 06:22:54; Lifecycle Status: Active; Minimum Order: 1; Mounting Type: Surface Mount, MLCC; Operating Temperature: -55°C ~ 125°C; Package / Case: 0603 (1608 Metric); packaging: TapeAndReel; partid: 2290; Part Status: Active; price: 0.02; series: CC; Size / Dimension: 0.063" L x 0.031" W (1.60mm x 0.80mm); Supplier 1: DigiKey; Supplier Part Number 1: 311-1796-1-ND; Temperature Coefficient: X7R; Thickness (Max): 0.035" (0.90mm); Voltage - Rated: 10V
C14 = CC0603KRX7R6BB104: CAP CER 0.1UF 10V X7R 0603; manufacturer: Yageo; Tolerance: ±10%; Part Number: CC0603KRX7R6BB104; Value: 0.1 µF; Applications: General Purpose; Capacitance: 0.1 µF; componentlink1description: Datasheet; componentlink1url: https://www.yageo.com/upload/media/product/productsearch/datasheet/mlcc/UPY-GPHC_X7R_6.3V-to-50V_18.pdf; componentlink2description: DigiKey Link; componentlink2url: https://www.digikey.com/en/products/detail/yageo/CC0603KRX7R6BB104/5883741; Device Package: 0603 (1608 Metric); lastupdated: 16/03/2022 06:22:39; Lifecycle Status: Active; Minimum Order: 1; Mounting Type: Surface Mount, MLCC; Operating Temperature: -55°C ~ 125°C; Package / Case: 0603 (1608 Metric); packaging: TapeAndReel; partid: 7937; Part Status: Active; price: 0.01; series: CC; Size / Dimension: 0.063" L x 0.031" W (1.60mm x 0.80mm); Supplier 1: DigiKey; Supplier Part Number 1: 311-4055-1-ND; Temperature Coefficient: X7R; Thickness (Max): 0.035" (0.90mm); Voltage - Rated: 10V
C15 = CC0603KRX7R6BB103: CAP CER 10000PF 10V X7R 0603; manufacturer: Yageo; Tolerance: ±10%; Part Number: CC0603KRX7R6BB103; Value: 10000 pF; Applications: General Purpose; Capacitance: 10000 pF; componentlink1description: Datasheet; componentlink1url: https://www.yageo.com/upload/media/product/productsearch/datasheet/mlcc/UPY-GPHC_X7R_6.3V-to-50V_18.pdf; componentlink2description: DigiKey Link; componentlink2url: https://www.digikey.com/en/products/detail/yageo/CC0603KRX7R6BB103/5883740; Device Package: 0603 (1608 Metric); lastupdated: 16/03/2022 06:22:27; Lifecycle Status: Active; Minimum Order: 1; Mounting Type: Surface Mount, MLCC; Operating Temperature: -55°C ~ 125°C; Package / Case: 0603 (1608 Metric); packaging: TapeAndReel; partid: 11852; Part Status: Active; price: 0.01; series: CC; Size / Dimension: 0.063" L x 0.031" W (1.60mm x 0.80mm); Supplier 1: DigiKey; Supplier Part Number 1: 311-4054-1-ND; Temperature Coefficient: X7R; Thickness (Max): 0.035" (0.90mm); Voltage - Rated: 10V
FB1-FB3 = 2506036017Y2: MULTI-LAYER CHIP BEAD; Manufacturer: Fair-Rite Products Corp.; Current Rating (Max): 2A; DC Resistance (DCR) (Max): 120mOhm; Filter Type: Signal Line; Number of Lines: 1; Part Number: 2506036017Y2; ComponentLink1Description: Datasheet; ComponentLink1URL: https://www.fair-rite.com/wp-content/themes/fair-rite/print_product.php?pid=29757; ComponentLink2Description: DigiKey Link; ComponentLink2URL: https://www.digikey.com/en/products/detail/fair-rite-products-corp/2506036017Y2/14635285; Device Package: 0603 (1608 Metric); Height (Max): 0.037" (0.95mm); Impedance @ Frequency: 600 Ohms @ 100 MHz; LastUpdated: 21/03/2022 18:53:23; Lifecycle Status: Active; Minimum Order: 1; Mounting Type: Surface Mount; Operating Temperature: -55°C ~ 125°C; Package / Case: 0603 (1608 Metric); Packaging: TapeAndReel; PartId: 2657; Part Status: Active; Price: 0.03; Series: -; Size / Dimension: 0.063" L x 0.031" W (1.60mm x 0.80mm); Supplier 1: DigiKey; Supplier Part Number 1: 1934-2506036017Y2CT-ND; Value: 600 Ohms @ 100 MHz
IC5 = LPC824M201JHI33Y: IC MCU 32BIT 32KB FLASH 32HVQFN; Manufacturer: NXP USA Inc.; Connectivity: I²C, SPI, UART/USART; Core Processor: ARM® Cortex®-M0+; Core Size: 32-Bit; Data Converters: A/D 12x12b; Number of I/O: 29; Oscillator Type: Internal; Peripherals: Brown-out Detect/Reset, DMA, POR, PWM, WDT; Program Memory Size: 32KB (32K x 8); RAM Size: 8K x 8; Speed: 30MHz; Voltage - Supply (Vcc/Vdd): 1.8V ~ 3.6V; Part Number: LPC824M201JHI33Y; ComponentLink1Description: Datasheet; ComponentLink1URL: https://www.nxp.com/docs/en/data-sheet/LPC82X.pdf; ComponentLink2Description: DigiKey Link; ComponentLink2URL: //digikey.com/product-detail/en/nxp-usa-inc/LPC824M201JHI33Y/568-13786-2-ND/5170008; Device Package: 32-VFQFN Exposed Pad; LastUpdated: 03/12/2019 17:42:55; Lifecycle Status: 0; Minimum Order: 1; Mounting Type: Surface Mount; Operating Temperature: -40°C ~ 105°C (TA); Package / Case: 32-VFQFN Exposed Pad; Packaging: TapeAndReel; PartId: 38; Part Status: Active; Price: 0.85; Program Memory Type: FLASH; Series: LPC82x; Supplier 1: DigiKey; Supplier Part Number 1: 568-13786-2-ND; Supplier Device Package: 32-HVQFN (5x5)

## Sheet Voltage Regulator.SchDoc: Voltage Regulator
size A4; SheetNumber: 5; SheetTotal: 6
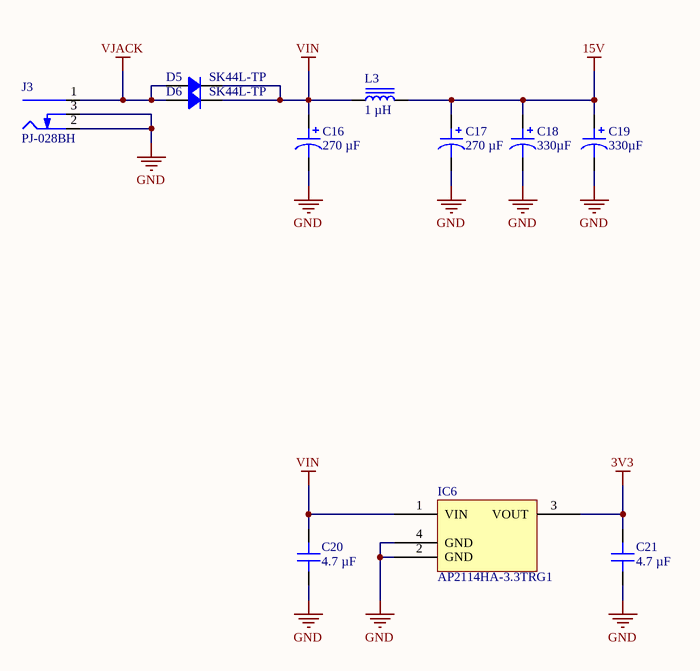
[diagram p4: Voltage Regulator.SchDoc]

### Parts
C16  270 µF  [CAP TH ALPOLY D10.00mm S5.00mm H14.00mm]
C17  270 µF  [CAP TH ALPOLY D10.00mm S5.00mm H14.00mm]
C18  330µF  [CAP TH ALUM ELEC D8.00mm S3.50mm H21.50mm]
C19  330µF  [CAP TH ALUM ELEC D8.00mm S3.50mm H21.50mm]
C20  4.7 µF  [CAP 0805_2012]
C21  4.7 µF  [CAP 0805_2012]
D5  SK44L-TP  [DO214AB SMC]
D6  SK44L-TP  [DO214AB SMC]
IC6  AP2114HA-3.3TRG1  [DIODES SOT-223]
J3  PJ-028BH  [CUI PJ-028BH]
L3  1 µH  [TAIYO YUDEN NRS8030]

### Nets
3V3: C21.2 IC6.3(VOUT)
15V: C17.1 C18.1 C19.1 L3.2
GND: C16.2 C17.2 C18.2 C19.2 C20.1 C21.1 IC6.2(GND) IC6.4(GND) J3.2(Outer) J3.3(SW)
VIN: C16.1 C20.2 D5.2 D6.2 IC6.1(VIN) L3.1
VJACK: D5.1 D6.1 J3.1(Centre)

### Notes on the sheet
- Title
- Size:
- Date:
- A4
- Number:
- Time:
- Revision:
- Sheet
- of
- File:

### Library data of the parts
C16 C17 = A759MU277M1VAAE022: CAP ALUM POLY 270UF 20% 35V TH; manufacturer: KEMET; ESR (Equivalent Series Resistance): 22mOhm; Lifetime @ Temp.: 2000 Hrs @ 125°C; Ripple Current @ High Frequency: 3.74 A @ 100 kHz; Ripple Current @ Low Frequency: 187 mA @ 120 Hz; Type: Polymer; Part Number: A759MU277M1VAAE022; Value: 270 µF; Applications: General Purpose; Capacitance: 270 µF; componentlink1description: Datasheet; componentlink1url: https://api.kemet.com/component-edge/download/datasheet/A759MU277M1VAAE022.pdf; componentlink2description: DigiKey Link; componentlink2url: https://www.digikey.com/en/products/detail/kemet/A759MU277M1VAAE022/13420072; Height - Seated (Max): 0.551" (14.00mm); lastupdated: 16/03/2022 07:18:21; Lead Spacing: 0.197" (5.00mm); Lifecycle Status: Active; Minimum Order: 1; Mounting Type: Through Hole; Operating Temperature: -55°C ~ 125°C; packaging: Bulk; partid: 4518; Part Status: Active; price: 0.26; series: A759; Size / Dimension: 0.394" Dia (10.00mm); Supplier 1: DigiKey; Supplier Part Number 1: 399-A759MU277M1VAAE022-ND; Tolerance: ±20%; Voltage - Rated: 35 V
C18 C19 = 860080574014: CAP ALUM 330UF 20% 35V THRU HOLE; manufacturer: Würth Elektronik; Impedance: 41 mOhms; Lifetime @ Temp.: 3000 Hrs @ 105°C; Polarization: Polar; Ripple Current @ High Frequency: 1.21A @ 100kHz; Part Number: 860080574014; Applications: General Purpose; Capacitance: 330µF; componentlink1description: Datasheet; componentlink1url: https://katalog.we-online.de/pbs/datasheet/860080574014.pdf; componentlink2description: DigiKey Link; componentlink2url: http://digikey.com/product-detail/en/w-rth-elektronik/860080574014/732-9106-1-ND/5729049; Device Package: Radial, Can; Height - Seated (Max): 0.846" (21.50mm); lastupdated: 08/09/2020 02:47:41; Lead Spacing: 0.138" (3.50mm); Lifecycle Status: Active; Minimum Order: 1; Mounting Type: Through Hole; Operating Temperature: -55°C ~ 105°C; Package / Case: Radial, Can; packaging: TapeAndBox; partid: 24697; Part Status: Active; price: 0.29; series: WCAP-ATLI; Size / Dimension: 0.315" Dia (8.00mm); Supplier 1: DigiKey; Supplier Part Number 1: 732-9106-1-ND; Tolerance: ±20%; value: 330µF; Voltage - Rated: 35V
C20 C21 = CL21A475KBQNNNE: CAP CER 4.7UF 50V X5R 0805; manufacturer: Samsung Electro-Mechanics; Tolerance: ±10%; Part Number: CL21A475KBQNNNE; Value: 4.7 µF; Applications: General Purpose; Capacitance: 4.7 µF; componentlink1description: Datasheet; componentlink1url: http://www.samsungsem.com/kr/support/product-search/mlcc/CL21A475KBQNNNE.jsp; componentlink2description: DigiKey Link; componentlink2url: https://www.digikey.com/en/products/detail/samsung-electro-mechanics/CL21A475KBQNNNE/3886906; Device Package: 0805 (2012 Metric); lastupdated: 16/03/2022 06:26:03; Lifecycle Status: Active; Minimum Order: 1; Mounting Type: Surface Mount, MLCC; Operating Temperature: -55°C ~ 85°C; Package / Case: 0805 (2012 Metric); packaging: TapeAndReel; partid: 3027; Part Status: Active; price: 0.04; series: CL; Size / Dimension: 0.079" L x 0.049" W (2.00mm x 1.25mm); Supplier 1: DigiKey; Supplier Part Number 1: 1276-1248-1-ND; Temperature Coefficient: X5R; Thickness (Max): 0.055" (1.40mm); Voltage - Rated: 50V
D5 D6 = SK44L-TP: DIODE SCHOTTKY 4A 40V SMC; Manufacturer: Micro Commercial Co; Current - Reverse Leakage @ Vr: 500 µA @ 40 V; Speed: Fast Recovery =< 500ns, > 200mA (Io); Voltage - Forward (Vf) (Max) @ If: 450 mV @ 4 A; Part Number: SK44L-TP; ComponentLink1Description: Datasheet; ComponentLink1URL: https://www.mccsemi.com/pdf/Products/SK42L-SK44L(DO-214AB).pdf; ComponentLink2Description: DigiKey Link; ComponentLink2URL: https://www.digikey.com/en/products/detail/micro-commercial-co/SK44L-TP/5418832; Current - Average Rectified (Io): 4A; Diode Type: Schottky; LastUpdated: 17/03/2022 08:59:56; Lifecycle Status: Active; Minimum Order: 1; Mounting Type: Surface Mount; Operating Temperature - Junction: -55°C ~ 125°C; Package / Case: DO-214AB, SMC; Packaging: TapeAndReel; PartId: 1693; Part Status: Active; Price: 0.15; Series: -; Supplier 1: DigiKey; Supplier Part Number 1: SK44L-TPMSCT-ND; Supplier Device Package: SMC (DO-214AB); Voltage - DC Reverse (Vr) (Max): 40 V
IC6 = AP2114HA-3.3TRG1: IC REG LINEAR 3.3V 1A SOT223; Manufacturer: Diodes Incorporated; Current - Quiescent (Iq): 90 µA; Number of Regulators: 1; Output Configuration: Positive; Output Type: Fixed; Protection Features: Over Current, Over Temperature; PSRR: 65dB (100Hz ~ 1kHz); Voltage Dropout (Max): 0.75V @ 1A; Voltage - Input (Max): 6V; Part Number: AP2114HA-3.3TRG1; ComponentLink1Description: Datasheet; ComponentLink1URL: https://www.diodes.com/assets/Datasheets/AP2114.pdf; ComponentLink2Description: DigiKey Link; ComponentLink2URL: https://www.digikey.com/en/products/detail/diodes-incorporated/AP2114HA-3-3TRG1/4770627; Current - Output: 1A; LastUpdated: 12/04/2022 23:08:40; Lifecycle Status: Active; Minimum Order: 1; Mounting Type: Surface Mount; Operating Temperature: -40°C ~ 85°C; Package / Case: TO-261-4, TO-261AA; Packaging: TapeAndReel; Part Status: Active; Price: 0.10; Series: -; Supplier 1: DigiKey; Supplier Part Number 1: AP2114HA-3.3TRG1DICT-ND; Supplier Device Package: SOT-223-3; Voltage - Output (Min/Fixed): 3.3V
J3 = PJ-028BH: CONN POWER JACK 2.5X5.5MM; Manufacturer: CUI Devices; Actual Diameter: 0.098" (2.50mm ID), 0.256" (6.50mm OD); Current Rating (Amps): 5 A; Gender: Male; Industry Recognized Mating Diameter: 2.50mm ID (0.098"), 5.50mm OD (0.217"); Internal Switch(s): Single Switch, Normally Closed; Material Flammability Rating: UL94 V-0; Mating Length/Depth: 0.354" (9.00mm); Number of Positions/Contacts: 2 Conductors, 3 Contacts; Shielding: Unshielded; Part Number: PJ-028BH; ComponentLink1Description: Datasheet; ComponentLink1URL: https://www.cuidevices.com/product/resource/digikeypdf/pj-028bh.pdf; ComponentLink2Description: DigiKey Link; ComponentLink2URL: https://www.digikey.com/en/products/detail/cui-devices/PJ-028BH/1644512; Connector Type: Jack; LastUpdated: 19/03/2022 04:09:31; Lifecycle Status: Active; Minimum Order: 1; Mounting Type: Through Hole; Packaging: Bag; Part Status: Active; Price: 0.56; Series: -; Supplier 1: DigiKey; Supplier Part Number 1: CP-028BH-ND; Termination: Kinked Pin
L3 = NRS8030T1R0NJGJ: FIXED IND 1UH 6.2A 11.7 MOHM SMD; Manufacturer: Taiyo Yuden; Current - Saturation: 7.8A; DC Resistance (DCR): 11.7mOhm Max; Frequency - Self Resonant: 120MHz; Inductance Frequency - Test: 100 kHz; Material - Core: Ferrite; Shielding: Shielded; Tolerance: ±30%; Type: Wirewound; Part Number: NRS8030T1R0NJGJ; ComponentLink1Description: Datasheet; ComponentLink1URL: https://www.yuden.co.jp/productdata/catalog/wound04_e.pdf; ComponentLink2Description: DigiKey Link; ComponentLink2URL: https://www.digikey.com/en/products/detail/taiyo-yuden/NRS8030T1R0NJGJ/2666000; Current Rating (Amps): 6.2 A; Device Package: Nonstandard; Height - Seated (Max): 0.118" (3.00mm); Inductance: 1 µH; LastUpdated: 16/03/2022 13:29:43; Lifecycle Status: Active; Minimum Order: 1; Mounting Type: Surface Mount; Operating Temperature: -25°C ~ 125°C; Package / Case: Nonstandard; Packaging: TapeAndReel; PartId: 5484; Part Status: Active; Price: 0.21; Series: NR, S Type; Size / Dimension: 0.315" L x 0.315" W (8.00mm x 8.00mm); Supplier 1: DigiKey; Supplier Part Number 1: 587-2962-1-ND; Value: 1 µH